# EAGLE design esquematico (EAGLE 9.6.2)
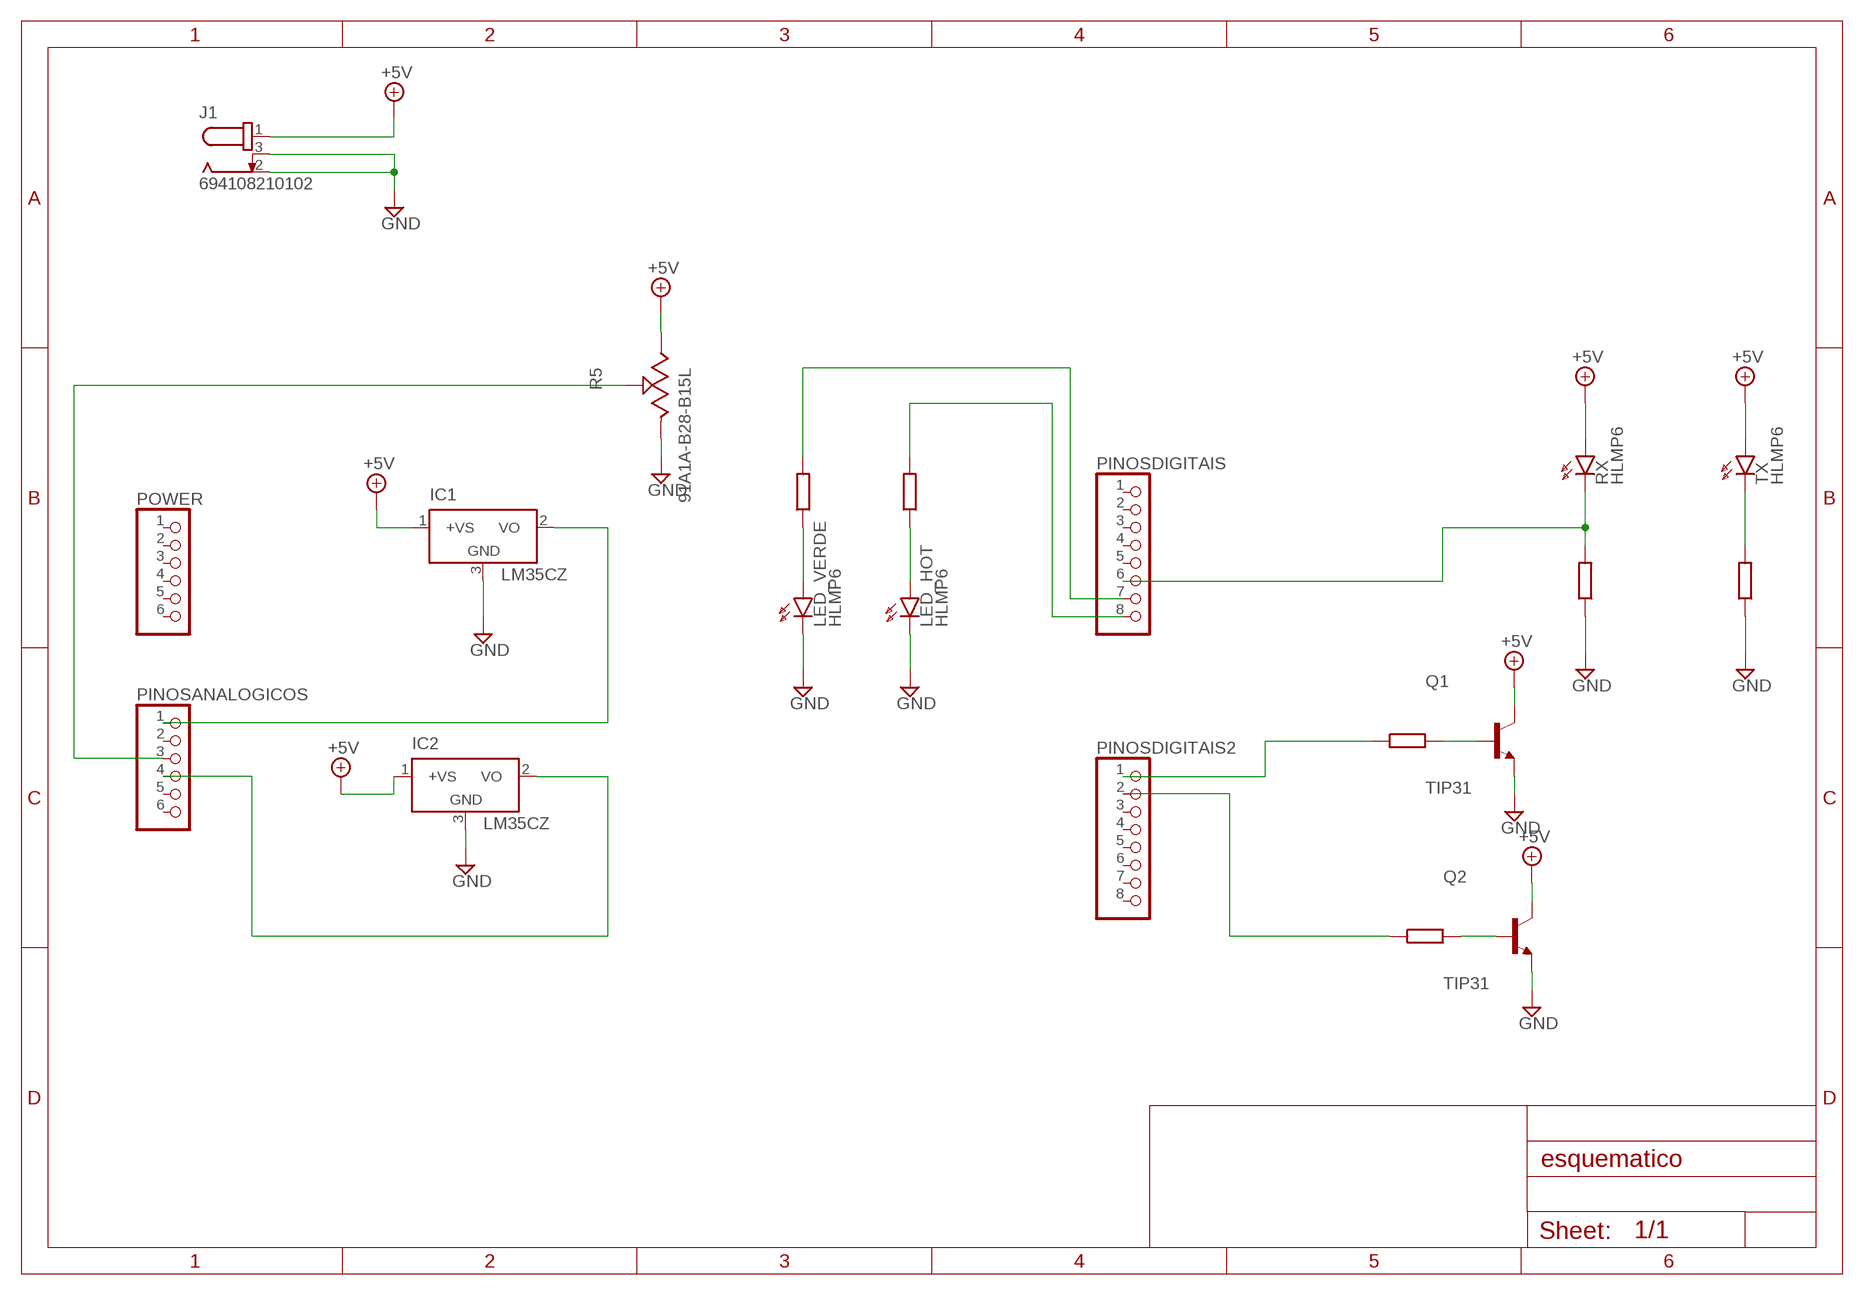
[diagram p0: schematic, sheet 1]

## Parts
IC1  LM35CZ  [TO92]
IC2  LM35CZ  [TO92]
J1  694108210102  [694108210102]
LED_HOT  HLMP6  [HLMP6]
LED_VERDE  HLMP6  [HLMP6]
PINOSANALOGICOS  PINHD-1X6  [1X06]
PINOSDIGITAIS  PINHD-1X8  [1X08]
PINOSDIGITAIS2  PINHD-1X8  [1X08]
POWER  PINHD-1X6  [1X06]
Q1  TIP31  [TO254P1060X482X2222-3]
Q2  TIP31  [TO254P1060X482X2222-3]
R5  91A1A-B28-B15L  [91A1A-B28-B15L-ND]
RX  HLMP6  [HLMP6]
TX  HLMP6  [HLMP6]

## Nets
+5V: IC1.1(+VS) IC2.1(+VS) J1.1 Q1.2(C) Q2.2(C) R5.3 RX.A TX.A
GND: IC1.3(GND) IC2.3(GND) J1.2 J1.3 LED_HOT.K LED_VERDE.K Q1.3(E) Q2.3(E) R5.1
N$1: IC2.2(VO) PINOSANALOGICOS.4
N$2: Q1.1(B)
N$3: LED_HOT.A
N$4: LED_VERDE.A
N$6: Q2.1(B)
N$7: PINOSDIGITAIS2.1
N$8: PINOSDIGITAIS2.2
N$9: PINOSDIGITAIS.6 RX.K
N$10: TX.K
N$11: PINOSDIGITAIS.8
N$12: PINOSDIGITAIS.7
N$13: PINOSANALOGICOS.3 R5.2
N$14: IC1.2(VO) PINOSANALOGICOS.1
Unconnected: PINOSANALOGICOS.2 PINOSANALOGICOS.5 PINOSANALOGICOS.6 PINOSDIGITAIS2.3 PINOSDIGITAIS2.4 PINOSDIGITAIS2.5 PINOSDIGITAIS2.6 PINOSDIGITAIS2.7 PINOSDIGITAIS2.8 PINOSDIGITAIS.1 PINOSDIGITAIS.2 PINOSDIGITAIS.3 PINOSDIGITAIS.4 PINOSDIGITAIS.5 POWER.1 POWER.2 POWER.3 POWER.4 POWER.5 POWER.6

## Library data of the parts
IC1 IC2 = lm35:LM35: Single-Supply Centigrade Temperature Sensor Vout = (10mV/°C x Temp °C) +5mmmV Source: http://www.national.com/ds/LM/LM35.pdf
J1 = DC Power Jacks:694108210102: DC POWER JACK - VERTICAL- THT - Ø 2.0 & 2.5 -WR-DC Manufacturer's datasheet <https://katalog.we-online.de/em/datasheet/6941xx210102.pdf>; CREATED_BY: PCBLayout.com; MANUFACTURER: WURTH ELEKTRONIK; MPN: 694108210102
LED_HOT LED_VERDE RX TX = display-hp:HLMP6: LED 2mm horizontal; MF: AGILENT TECHNOLOGIES; MPN: HLMP-6500; OC_FARNELL: 1652490; OC_NEWARK: 40K0088
PINOSANALOGICOS POWER = pinhead:PINHD-1X6: PIN HEADER
PINOSDIGITAIS PINOSDIGITAIS2 = pinhead:PINHD-1X8: PIN HEADER
Q1 Q2 = TIP31:TIP31: Bipolar (BJT) Transistor NPN 40V 3A 3MHz 2W Through Hole TO-220AB Check prices <https://pricing.snapeda.com/parts/TIP31/ON%20Semiconductor/view-part?ref=eda>; AVAILABILITY: In Stock; DESCRIPTION: Bipolar (BJT) Transistor NPN 60V 3A 3MHz 2W Through Hole TO-220AB; MF: ON Semiconductor; MP: TIP31; PACKAGE: TO-220-3 ON Semiconductor; PRICE: None
R5 = Potentiometer_Trimmers:91A1A-B28-B15L: POT 10K OHM 1W PLASTIC LINEAR Manufacturer's datasheet <https://www.bourns.com/docs/Product-Datasheets/91_95.pdf>; CREATED_BY: PCBLayout.com; DIGIKEY_PARTNO: 91A1A-B28-B15L-ND; MANUFACTURER: Bourns Inc.; MPN: 91A1A-B28-B15L

## Net classes
0 default: width 0.305 mm, drill 0.305 mm, clearance 0.254 mm

## Board
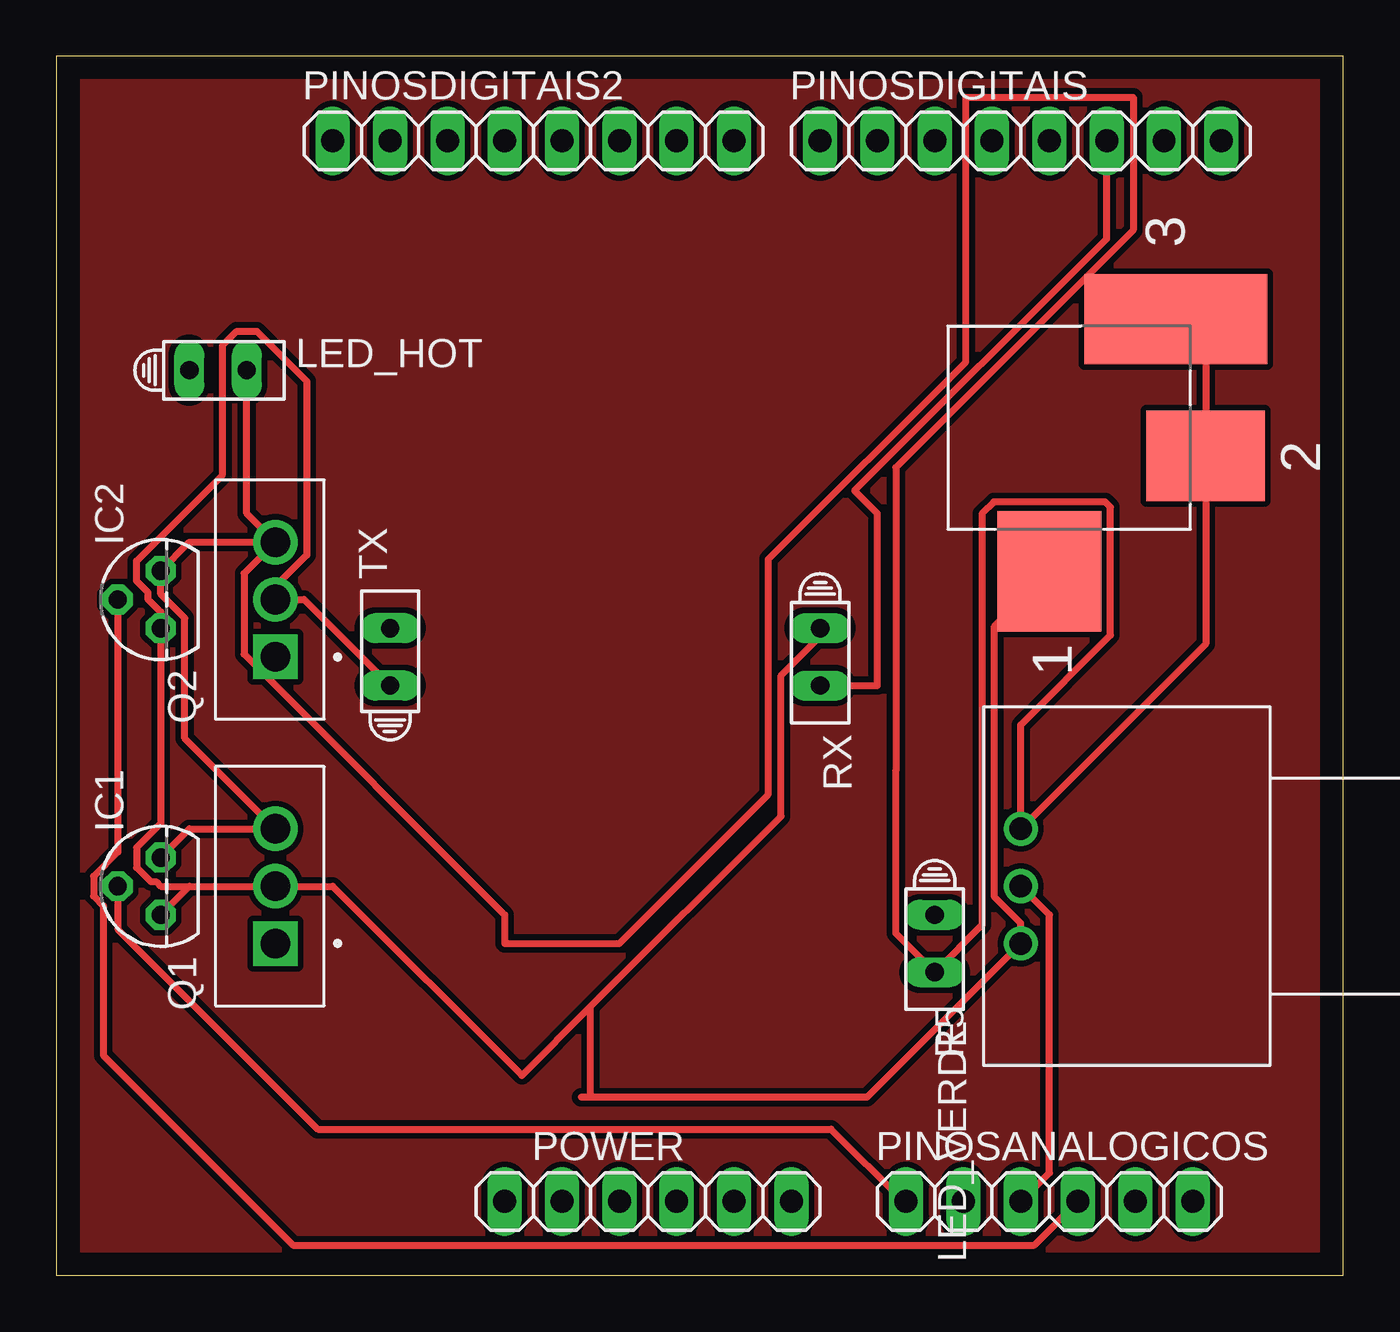
[diagram p1: board, top side]

Size 57 x 54 mm. Coordinates in mm from the lower left corner, seen from the top.
Outline: 0,54 0,0 57,0 57,54 0,54
Copper layers (1*16): Top 0.035mm / dielectric 1.5mm / Bottom 0.035mm
Design rules "default": minimum track width 6mil, minimum drill 0.35mm, track to track 6mil, track to pad 6mil, pad to pad 6mil, via to via 6mil, smd to smd 6mil, copper to edge 40mil, drill to drill 6mil, minimum pad ring 10mil, minimum via ring 8mil, stop-mask expansion 4mil, vias tented up to drill 0mil, thermal gap 10mil

### Footprints (pad centres in the part's own frame; a part is rotated, then mirrored left to right if it is on the bottom)
TO92 = drill 0.813 octagon: 1 -1.27,0; 2 0,1.905; 3 1.27,0
694108210102 = smd 5.33 x 4.6: 1 -6.365,0 | smd 4 x 5.25: 2 -1.25,-6.925 | smd 4 x 8.1: 3 4.8,-5.6
HLMP6 = drill 0.813 long: A -1.27,0; K 1.27,0
1X06 = drill 1.016 long: 1 -6.35,0; 2 -3.81,0; 3 -1.27,0; 4 1.27,0; 5 3.81,0; 6 6.35,0
1X08 = drill 1.016 long: 1 -8.89,0; 2 -6.35,0; 3 -3.81,0; 4 -1.27,0; 5 1.27,0; 6 3.81,0; 7 6.35,0; 8 8.89,0
TO254P1060X482X2222-3 = drill 1.31 square: 1 -2.54,0 | drill 1.31: 2 0,0; 3 2.54,0
91A1A-B28-B15L-ND = drill 1: 1 2.54,0; 2 0,0; 3 -2.54,0

### Placement (x,y rotation side)
IC1  4.62,17.24 90 top
IC2  4.62,29.94 90 top
J1  43.99,37.56 90 top
LED_HOT  7.16,40.1 0 top
LED_VERDE  38.91,14.7 270 top
PINOSANALOGICOS  43.99,3.27 0 top
PINOSDIGITAIS  42.72,50.26 0 top
PINOSDIGITAIS2  21.13,50.26 0 top
POWER  26.21,3.27 0 top
Q1  9.7,17.24 90 top
Q2  9.7,29.94 90 top
R5  42.72,17.24 90 top
RX  33.83,27.4 270 top
TX  14.78,27.4 90 top

### Tracks (layer width: path | path; a pad name or v marks a point on that pad's centre or on a via)
+5V
  Top 0.305: J1.1 41.56,28.77 41.56,16.76 42.72,15.6 R5.3 35.91,7.89 23.67,7.89 | 23.67,7.89 23.25,7.89 | Q1.2 4.62,17.24 4.42,17.44 4.18,17.44 3.55,18.07 3.55,18.95 4.62,20.02 IC2.1 4.62,29.39 4.06,29.95 4.06,30.26 3.55,30.77 3.55,31.65 7.36,35.46 7.36,41.2 7.99,41.83 8.87,41.83 11.09,39.61 11.09,31.91 9.7,30.52 Q2.2 10.97,29.94 TX.A | IC1.1 5.89,17.24 Q1.2 | Q1.2 12.24,17.24 20.62,8.86 23.67,11.91 | RX.A 33.83,28.3 32.1,26.57 32.1,20.34 23.67,11.91 | 23.67,7.89 23.67,11.91
GND
  Top 0.305: J1.3 50.91,41.03 J1.2 50.91,27.98 R5.1 42.72,24.39 46.7,28.36 46.7,34.03 46.46,34.27 41.52,34.27 41,33.75 41,15.52 LED_VERDE.K 37.18,15.16 37.18,22.34 37.19,22.35 37.19,35.8 47.7,46.3 47.7,52.19 40.28,52.19 40.28,45.18 40.28,44.14 40.28,40.47 31.54,31.73 31.54,21.3 24.94,14.7 19.86,14.7 19.86,15.97 8.31,27.52 8.31,31.09 Q2.3 | IC1.3 5.89,19.78 Q1.3 5.69,23.79 5.69,29.11 4.62,30.18 IC2.3 5.89,32.48 Q2.3 | Q2.3 8.43,33.75 LED_HOT.K
N$1
  Top 0.305: IC2.2 2.71,18.75 1.65,17.68 1.65,16.8 2.08,16.37 2.08,9.75 10.49,1.34 43.33,1.34 PINOSANALOGICOS.4
N$9
  Top 0.305: PINOSDIGITAIS.6 46.53,45.92 35.36,34.76 | 35.36,34.76 | RX.K 36.37,26.13 36.37,33.75 35.36,34.76
N$13
  Top 0.305: PINOSANALOGICOS.3 43.99,4.54 43.99,15.97 R5.2
N$14
  Top 0.305: IC1.2 2.71,15.34 11.58,6.47 34.31,6.47 37.51,3.27 PINOSANALOGICOS.1
TERRA
  pour Top: 0.81,54.07 56.69,54.07 56.69,0.73 0.81,0.73